# Altium schematic sheet top.SchDoc
size A2
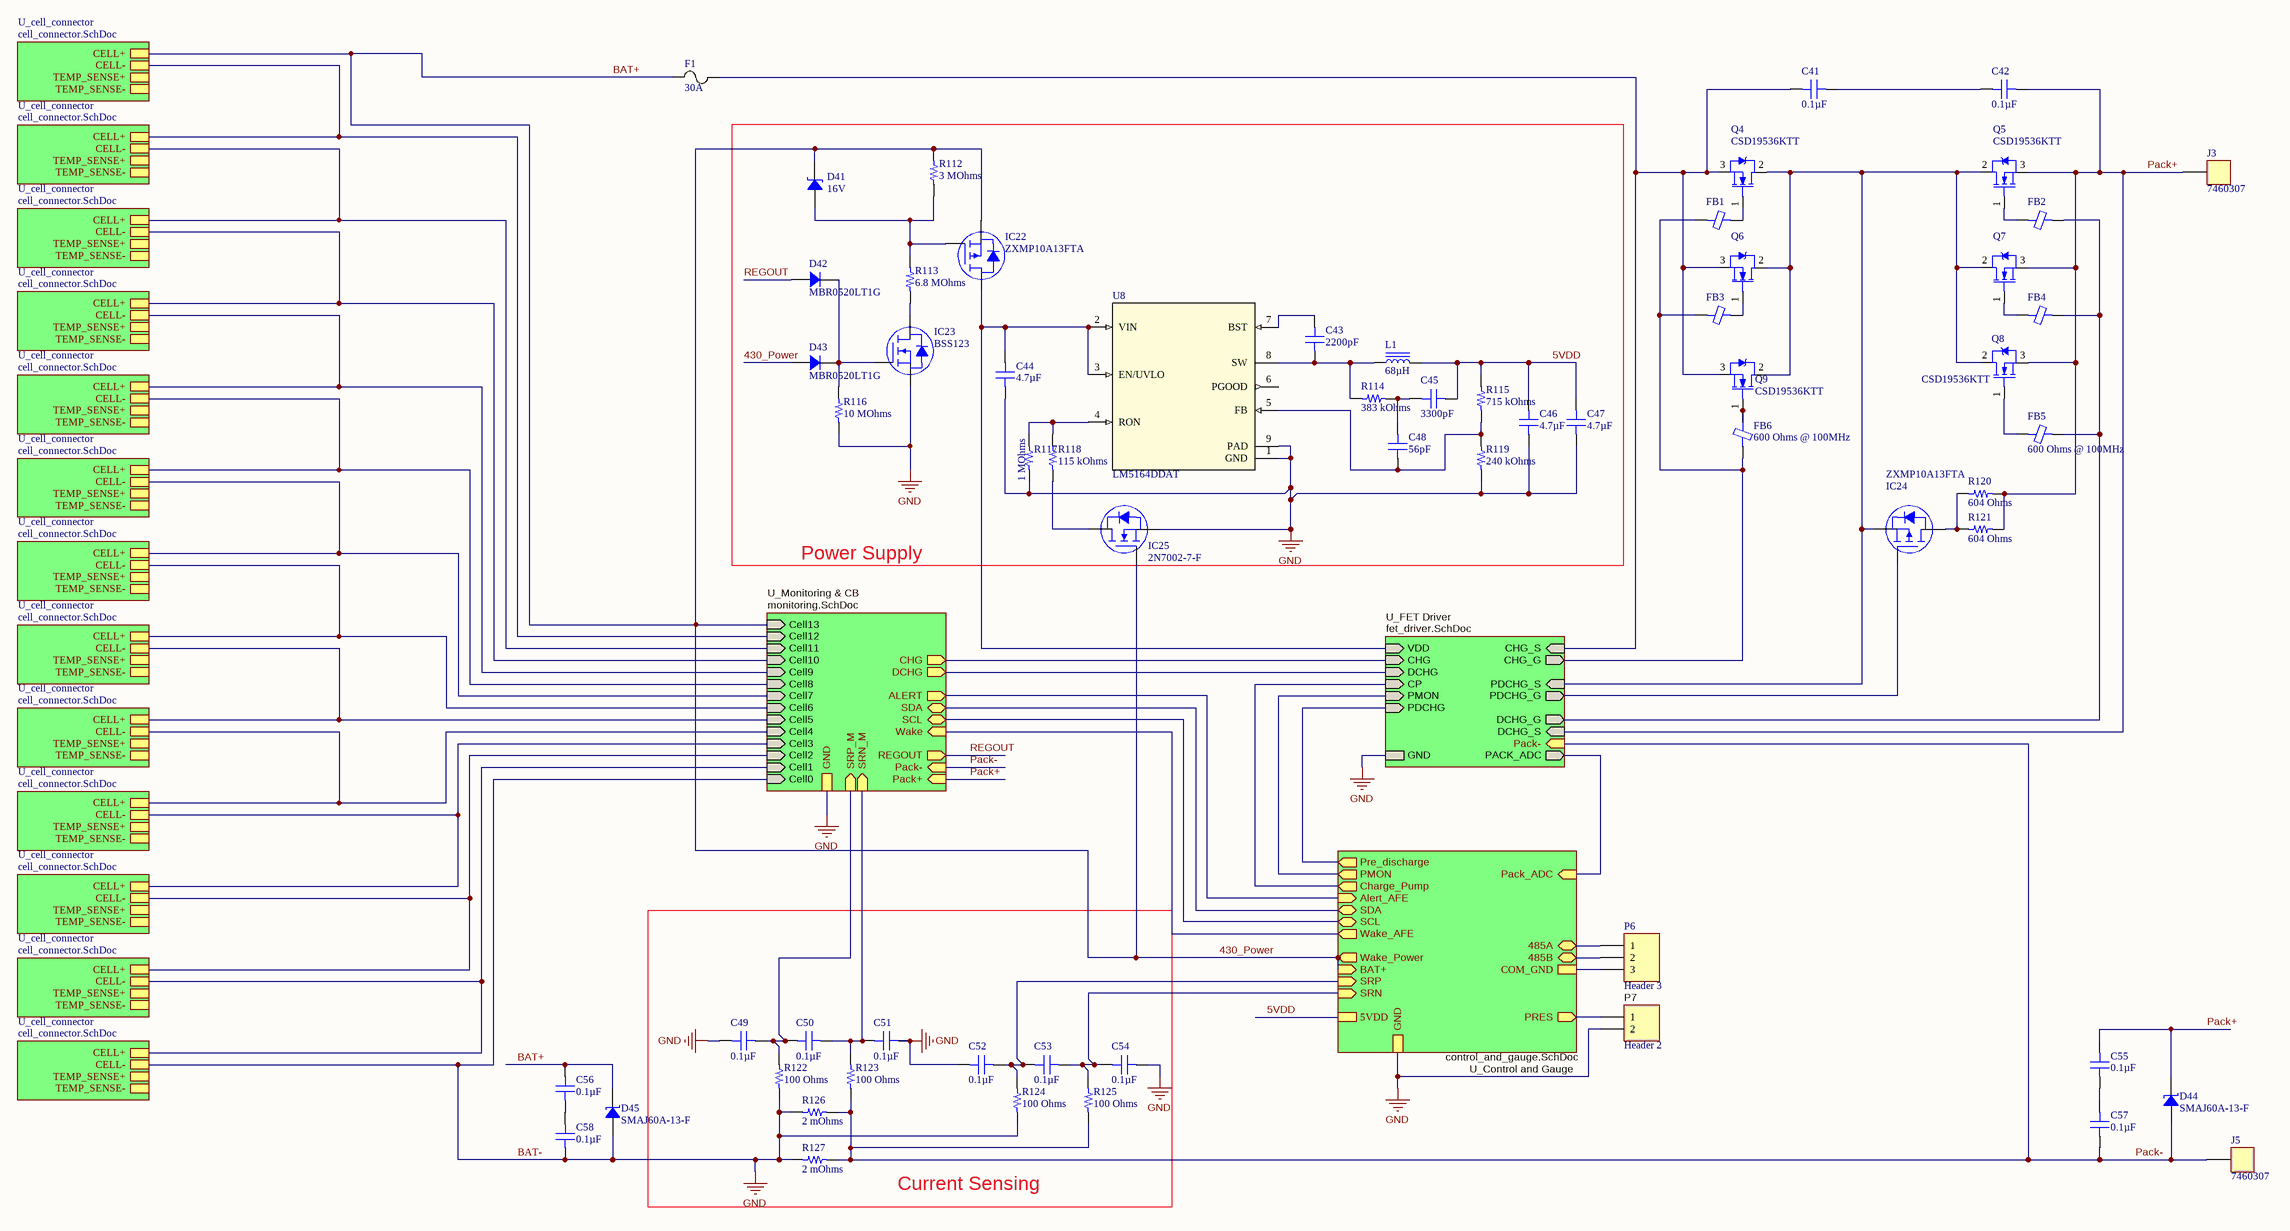
[diagram p0: top.SchDoc]

## Parts
C41  0.1µF  [CAP 0603_1608]
C42  0.1µF  [CAP 0603_1608]
C43  2200pF  [CAP 0603_1608]
C44  4.7µF  [CAP 1210_3225 - 2.2MM]
C45  3300pF  [CAP 0603_1608]
C46  4.7µF  [CAP 0805_2012]
C47  4.7µF  [CAP 0805_2012]
C48  56pF  [CAP 0603_1608]
C49  0.1µF  [CAP 0603_1608]
C50  0.1µF  [CAP 0603_1608]
C51  0.1µF  [CAP 0603_1608]
C52  0.1µF  [CAP 0603_1608]
C53  0.1µF  [CAP 0603_1608]
C54  0.1µF  [CAP 0603_1608]
C55  0.1µF  [CAP 0603_1608]
C56  0.1µF  [CAP 0603_1608]
C57  0.1µF  [CAP 0603_1608]
C58  0.1µF  [CAP 0603_1608]
D41  Voltage - Zener (Nom) (Vz): 16V  [SOD-123]  (hidden comment: MMSZ5246B-7-F)
D42  MBR0520LT1G  [SOD-123]
D43  MBR0520LT1G  [SOD-123]
D44  SMAJ60A-13-F  [DO214AC SMA]
D45  SMAJ60A-13-F  [DO214AC SMA]
F1  Fuse Current: 30A  [FUS_LITTELFUSE_0456_30A_LTF]  (hidden comment: 0456030.ER)
FB1  600 Ohms @ 100MHz  [FER 0603_1608]  (value not drawn)
FB2  600 Ohms @ 100MHz  [FER 0603_1608]  (value not drawn)
FB3  600 Ohms @ 100MHz  [FER 0603_1608]  (value not drawn)
FB4  600 Ohms @ 100MHz  [FER 0603_1608]  (value not drawn)
FB5  600 Ohms @ 100MHz  [FER 0603_1608]
FB6  600 Ohms @ 100MHz  [FER 0603_1608]
IC22  ZXMP10A13FTA  [DIODES SOT-23-3]
IC23  BSS123  [ON SEMI SOT-23-3]
IC24  ZXMP10A13FTA  [DIODES SOT-23-3]
IC25  2N7002-7-F  [DIODES SOT-23-3]
J3  7460307  [7460307]
J5  7460307  [7460307]
L1  68µH  [TDK SLF10145]
P6  Header 3  [HDR1X3]
P7  Header 2  [HDR1X2]
Q4  CSD19536KTT  [DDPAK]
Q5  CSD19536KTT  [DDPAK]
Q6  CSD19536KTT  [DDPAK]  (value not drawn)
Q7  CSD19536KTT  [DDPAK]  (value not drawn)
Q8  CSD19536KTT  [DDPAK]
Q9  CSD19536KTT  [DDPAK]
R112  3 MOhms  [RES 0603_1608]
R113  6.8 MOhms  [RES 0603_1608]
R114  383 kOhms  [RES 0603_1608]
R115  715 kOhms  [RES 0603_1608]
R116  10 MOhms  [RES 0603_1608]
R117  1 MOhms  [RES 0603_1608]
R118  115 kOhms  [RES 0603_1608]
R119  240 kOhms  [RES 0603_1608]
R120  604 Ohms  [RES 2512_6432]
R121  604 Ohms  [RES 2512_6432]
R122  100 Ohms  [RES 0603_1608]
R123  100 Ohms  [RES 0603_1608]
R124  100 Ohms  [RES 0603_1608]
R125  100 Ohms  [RES 0603_1608]
R126  2 mOhms  [STACKPOLE CSR2512]
R127  2 mOhms  [STACKPOLE CSR2512]
U8  LM5164DDAT  [PowerSOIC_8]

## Blocks framed on the sheet
Power Supply: C43-C48 D41-D43 IC22 IC23 IC25 L1 R112-R119 U8
Current Sensing: C49-C54 R122-R127

## Sub-sheets
U_cell_connector = cell_connector.SchDoc: CELL+, CELL-, TEMP_SENSE+, TEMP_SENSE-
U_cell_connector = cell_connector.SchDoc: CELL+, CELL-, TEMP_SENSE+, TEMP_SENSE-
U_cell_connector = cell_connector.SchDoc: CELL+, CELL-, TEMP_SENSE+, TEMP_SENSE-
U_cell_connector = cell_connector.SchDoc: CELL+, CELL-, TEMP_SENSE+, TEMP_SENSE-
U_cell_connector = cell_connector.SchDoc: CELL+, CELL-, TEMP_SENSE+, TEMP_SENSE-
U_cell_connector = cell_connector.SchDoc: CELL+, CELL-, TEMP_SENSE+, TEMP_SENSE-
U_cell_connector = cell_connector.SchDoc: CELL+, CELL-, TEMP_SENSE+, TEMP_SENSE-
U_cell_connector = cell_connector.SchDoc: CELL+, CELL-, TEMP_SENSE+, TEMP_SENSE-
U_cell_connector = cell_connector.SchDoc: CELL+, CELL-, TEMP_SENSE+, TEMP_SENSE-
U_cell_connector = cell_connector.SchDoc: CELL+, CELL-, TEMP_SENSE+, TEMP_SENSE-
U_cell_connector = cell_connector.SchDoc: CELL+, CELL-, TEMP_SENSE+, TEMP_SENSE-
U_cell_connector = cell_connector.SchDoc: CELL+, CELL-, TEMP_SENSE+, TEMP_SENSE-
U_cell_connector = cell_connector.SchDoc: CELL+, CELL-, TEMP_SENSE+, TEMP_SENSE-
U_Control and Gauge = control_and_gauge.SchDoc: SRP (in), SRN (in), BAT+ (in), Wake_Power (out), Wake_AFE (out), Alert_AFE (in), Pre_discharge (out), Charge_Pump (out), Pack_ADC (in), GND, 485B (bidir), 485A (bidir), PMON (out), SDA (bidir), SCL (bidir), PRES (out), 5VDD, COM_GND
U_FET Driver = fet_driver.SchDoc: DCHG_S (in), CHG_S (in), CHG_G (out), DCHG_G (out), PDCHG_G (out), CHG (in), CP (in), DCHG (in), PMON (in), PDCHG (in), PACK_ADC (out), VDD (in), GND, PDCHG_S (in), Pack- (in)
U_Monitoring & CB = monitoring.SchDoc: Cell0 (in), Cell1 (in), Cell2 (in), Cell3 (in), Cell4 (in), Cell5 (in), Cell6 (in), Cell7 (in), Cell8 (in), Cell9 (in), Cell10 (in), Cell11 (in), Cell12 (in), Cell13 (in), ALERT (out), CHG (out), DCHG (out), SDA (bidir), SCL (bidir), Pack+ (in), Pack- (in), Wake (in), REGOUT (out), GND, SRN_M (in), SRP_M (in)

## Nets
BAT-: C44.1 C46.1 C47.1 C49.1 C51.2 C52.1 C54.2 C58.1 D45.1 IC23.2(S) IC25.2(S) P7.2 R116.1 R117.2 R119.1 R122.2 R124.2 R126.1 R127.1 U8.1(GND) U8.9(PAD) ; sheet U_Monitoring & CB/Cell0, sheet U_Monitoring & CB/GND, sheet U_Control and Gauge/GND, sheet U_FET Driver/GND, sheet U_cell_connector/CELL-  [also labelled GND]
5VDD: C45.2 C46.2 C47.2 L1.2 R115.2 ; sheet U_Control and Gauge/5VDD
430_Power: C56.2 D41.2 D43.1 D45.2 F1.1 IC22.2(S) IC25.1(G) R112.2 ; sheet U_Monitoring & CB/Cell13, sheet U_Control and Gauge/BAT+, sheet U_Control and Gauge/Wake_Power, sheet U_cell_connector/CELL+  [also labelled BAT+]
Pack+: C42.1 C55.2 D44.2 J3.1 Q5.3(S) Q7.3(S) Q8.3(S) R120.2 R121.2 ; sheet U_Monitoring & CB/Pack+, sheet U_FET Driver/DCHG_S
Pack-: C57.1 D44.1 J5.1 R123.2 R125.2 R126.2 R127.2 ; sheet U_Monitoring & CB/Pack-, sheet U_FET Driver/Pack-
REGOUT: D42.1 ; sheet U_Monitoring & CB/REGOUT
NetC41_1: C41.1 C42.2
NetC41_2: C41.2 F1.2 Q4.3(S) Q6.3(S) Q9.3(S) ; sheet U_FET Driver/CHG_S
NetC43_1: C43.1 L1.1 R114.1 U8.8(SW)
NetC43_2: C43.2 U8.7(BST)
NetC44_2: C44.2 IC22.3(D) U8.2(VIN) U8.3(EN/UVLO) ; sheet U_FET Driver/VDD
NetC45_1: C45.1 C48.2 R114.2
NetC48_1: C48.1 R115.1 R119.2 U8.5(FB)
NetC49_2: C49.2 C50.1 R122.1 ; sheet U_Monitoring & CB/SRP_M
NetC50_2: C50.2 C51.1 R123.1 ; sheet U_Monitoring & CB/SRN_M
NetC52_2: C52.2 C53.1 R124.1 ; sheet U_Control and Gauge/SRP
NetC53_2: C53.2 C54.1 R125.1 ; sheet U_Control and Gauge/SRN
NetC55_1: C55.1 C57.2
NetC56_1: C56.1 C58.2
NetD41_1: D41.1 IC22.1(G) R112.1 R113.2
NetD42_2: D42.2 D43.2 IC23.1(G) R116.2
NetFB1_1: FB1.1 Q4.1(G)
NetFB1_2: FB1.2 FB3.2 FB6.1 ; sheet U_FET Driver/CHG_G
NetFB2_1: FB2.1 FB4.1 FB5.1 ; sheet U_FET Driver/DCHG_G
NetFB2_2: FB2.2 Q5.1(G)
NetFB3_1: FB3.1 Q6.1(G)
NetFB4_2: FB4.2 Q7.1(G)
NetFB5_2: FB5.2 Q8.1(G)
NetFB6_2: FB6.2 Q9.1(G)
NetIC23_3: IC23.3(D) R113.1
NetIC24_1: IC24.1(G) ; sheet U_FET Driver/PDCHG_G
NetIC24_2: IC24.2(S) Q4.2(D) Q5.2(D) Q6.2(D) Q7.2(D) Q8.2(D) Q9.2(D) ; sheet U_FET Driver/PDCHG_S
NetIC24_3: IC24.3(D) R120.1 R121.1
NetIC25_3: IC25.3(D) R118.1
NetP6_1: P6.1 ; sheet U_Control and Gauge/485A
NetP6_2: P6.2 ; sheet U_Control and Gauge/485B
NetP6_3: P6.3 ; sheet U_Control and Gauge/COM_GND
NetP7_1: P7.1 ; sheet U_Control and Gauge/PRES
NetR117_1: R117.1 R118.2 U8.4(RON)
(unnamed): sheet U_Monitoring & CB/Cell1, sheet U_cell_connector/CELL+, sheet U_cell_connector/CELL-
(unnamed): sheet U_Monitoring & CB/Cell2, sheet U_cell_connector/CELL+, sheet U_cell_connector/CELL-
(unnamed): sheet U_Monitoring & CB/Cell3, sheet U_cell_connector/CELL+, sheet U_cell_connector/CELL-
(unnamed): sheet U_Monitoring & CB/Cell4, sheet U_cell_connector/CELL+, sheet U_cell_connector/CELL-
(unnamed): sheet U_Monitoring & CB/Cell5, sheet U_cell_connector/CELL+, sheet U_cell_connector/CELL-
(unnamed): sheet U_Monitoring & CB/Cell6, sheet U_cell_connector/CELL+, sheet U_cell_connector/CELL-
(unnamed): sheet U_Monitoring & CB/Cell7, sheet U_cell_connector/CELL+, sheet U_cell_connector/CELL-
(unnamed): sheet U_Monitoring & CB/Cell8, sheet U_cell_connector/CELL+, sheet U_cell_connector/CELL-
(unnamed): sheet U_Monitoring & CB/Cell9, sheet U_cell_connector/CELL+, sheet U_cell_connector/CELL-
(unnamed): sheet U_Monitoring & CB/Cell10, sheet U_cell_connector/CELL+, sheet U_cell_connector/CELL-
(unnamed): sheet U_Monitoring & CB/Cell11, sheet U_cell_connector/CELL+, sheet U_cell_connector/CELL-
(unnamed): sheet U_Monitoring & CB/Cell12, sheet U_cell_connector/CELL+, sheet U_cell_connector/CELL-
(unnamed): sheet U_Monitoring & CB/ALERT, sheet U_Control and Gauge/Alert_AFE
(unnamed): sheet U_Monitoring & CB/CHG, sheet U_FET Driver/CHG
(unnamed): sheet U_Monitoring & CB/DCHG, sheet U_FET Driver/DCHG
(unnamed): sheet U_Monitoring & CB/SDA, sheet U_Control and Gauge/SDA
(unnamed): sheet U_Monitoring & CB/SCL, sheet U_Control and Gauge/SCL
(unnamed): sheet U_Monitoring & CB/Wake, sheet U_Control and Gauge/Wake_AFE
(unnamed): sheet U_Control and Gauge/Pre_discharge, sheet U_FET Driver/PDCHG
(unnamed): sheet U_Control and Gauge/Charge_Pump, sheet U_FET Driver/CP
(unnamed): sheet U_Control and Gauge/Pack_ADC, sheet U_FET Driver/PACK_ADC
(unnamed): sheet U_Control and Gauge/PMON, sheet U_FET Driver/PMON

Not connected (* = marked no-connect by the designer): U8 6(PGOOD)

## Library data of the parts
C41 C42 C55-C58 = GCJ188R72A104KA01D: CAP CER 0.1UF 100V X7R 0603; Manufacturer: Murata Electronics; Tolerance: ±10%; Part Number: GCJ188R72A104KA01D; Value: 0.1µF; Applications: Automotive, Boardflex Sensitive; Capacitance: 0.1µF; ComponentLink1Description: Datasheet; ComponentLink1URL: https://www.murata.com/~/media/webrenewal/support/library/catalog/products/capacitor/mlcc/c03e.ashx?la=en-us; ComponentLink2Description: DigiKey Link; ComponentLink2URL: http://digikey.com/product-detail/en/murata-electronics/GCJ188R72A104KA01D/490-13420-1-ND/6012292; Device Package: 0603 (1608 Metric); Features: Soft Termination; LastUpdated: 9/2/2020 1:03:01 AM; Lifecycle Status: Active; Minimum Order: 1; Mounting Type: Surface Mount, MLCC; Operating Temperature: -55°C ~ 125°C; Package / Case: 0603 (1608 Metric); Packaging: TapeAndReel; PartId: 17976; Part Status: Active; Price: 0.05; Ratings: AEC-Q200; Series: GCJ; Size / Dimension: 0.063" L x 0.031" W (1.60mm x 0.80mm); Supplier 1: DigiKey; Supplier Part Number 1: 490-13420-1-ND; Temperature Coefficient: X7R; Thickness (Max): 0.035" (0.90mm); Voltage - Rated: 100V
C43 = C1608C0G1H222J080AA: CAP CER 2200PF 50V C0G 0603; Manufacturer: TDK Corporation; Temperature Coefficient: C0G, NP0; Tolerance: ±5%; Part Number: C1608C0G1H222J080AA; Value: 2200pF; Applications: General Purpose; Capacitance: 2200pF; ComponentLink1Description: Datasheet; ComponentLink1URL: https://product.tdk.com/info/en/catalog/datasheets/mlcc_commercial_general_en.pdf?ref_disty=digikey; ComponentLink2Description: DigiKey Link; ComponentLink2URL: http://digikey.com/product-detail/en/tdk-corporation/C1608C0G1H222J080AA/445-1297-1-ND/567684; Device Package: 0603 (1608 Metric); Features: Low ESL; LastUpdated: 9/2/2020 1:03:24 AM; Lifecycle Status: Active; Minimum Order: 1; Mounting Type: Surface Mount, MLCC; Operating Temperature: -55°C ~ 125°C; Package / Case: 0603 (1608 Metric); Packaging: TapeAndReel; PartId: 8679; Part Status: Active; Price: 0.03; Series: C; Size / Dimension: 0.063" L x 0.031" W (1.60mm x 0.80mm); Supplier 1: DigiKey; Supplier Part Number 1: 445-1297-1-ND; Thickness (Max): 0.035" (0.90mm); Voltage - Rated: 50V
C44 = C3225X7S2A475K200AB: CAP CER 4.7UF 100V X7S 1210; Manufacturer: TDK Corporation; Tolerance: ±10%; Part Number: C3225X7S2A475K200AB; Value: 4.7µF; Applications: General Purpose; Capacitance: 4.7µF; ComponentLink1Description: Datasheet; ComponentLink1URL: https://product.tdk.com/info/en/catalog/datasheets/mlcc_commercial_midvoltage_en.pdf?ref_disty=digikey; ComponentLink2Description: DigiKey Link; ComponentLink2URL: http://digikey.com/product-detail/en/tdk-corporation/C3225X7S2A475K200AB/445-6042-1-ND/2444083; Device Package: 1210 (3225 Metric); LastUpdated: 9/2/2020 1:10:42 AM; Lifecycle Status: Active; Minimum Order: 1; Mounting Type: Surface Mount, MLCC; Operating Temperature: -55°C ~ 125°C; Package / Case: 1210 (3225 Metric); Packaging: TapeAndReel; PartId: 24496; Part Status: Active; Price: 0.50; Series: C; Size / Dimension: 0.126" L x 0.098" W (3.20mm x 2.50mm); Supplier 1: DigiKey; Supplier Part Number 1: 445-6042-1-ND; Temperature Coefficient: X7S; Thickness (Max): 0.087" (2.20mm); Voltage - Rated: 100V
C45 = CGA3E2X7R1H332K080AA: CAP CER 3300PF 50V X7R 0603; Manufacturer: TDK Corporation; Tolerance: ±10%; Part Number: CGA3E2X7R1H332K080AA; Value: 3300pF; Applications: Automotive; Capacitance: 3300pF; ComponentLink1Description: Datasheet; ComponentLink1URL: https://product.tdk.com/info/en/catalog/datasheets/mlcc_automotive_general_en.pdf?ref_disty=digikey; ComponentLink2Description: DigiKey Link; ComponentLink2URL: http://digikey.com/product-detail/en/tdk-corporation/CGA3E2X7R1H332K080AA/445-6921-1-ND/2672939; Device Package: 0603 (1608 Metric); LastUpdated: 9/2/2020 1:03:02 AM; Lifecycle Status: Active; Minimum Order: 1; Mounting Type: Surface Mount, MLCC; Operating Temperature: -55°C ~ 125°C; Package / Case: 0603 (1608 Metric); Packaging: TapeAndReel; PartId: 17741; Part Status: Active; Price: 0.01; Ratings: AEC-Q200; Series: CGA; Size / Dimension: 0.063" L x 0.031" W (1.60mm x 0.80mm); Supplier 1: DigiKey; Supplier Part Number 1: 445-6921-1-ND; Temperature Coefficient: X7R; Thickness (Max): 0.035" (0.90mm); Voltage - Rated: 50V
C46 C47 = CC0805KKX7R7BB475: CAP CER 4.7UF 16V X7R 0805; Manufacturer: Yageo; Tolerance: ±10%; Part Number: CC0805KKX7R7BB475; Value: 4.7µF; Applications: General Purpose; Capacitance: 4.7µF; ComponentLink1Description: Datasheet; ComponentLink1URL: https://www.yageo.com/upload/media/product/productsearch/datasheet/mlcc/UPY-GPHC_X7R_6.3V-to-50V_18.pdf; ComponentLink2Description: DigiKey Link; ComponentLink2URL: http://digikey.com/product-detail/en/yageo/CC0805KKX7R7BB475/311-1883-1-ND/5195785; Device Package: 0805 (2012 Metric); LastUpdated: 9/2/2020 1:04:23 AM; Lifecycle Status: Active; Minimum Order: 1; Mounting Type: Surface Mount, MLCC; Operating Temperature: -55°C ~ 125°C; Package / Case: 0805 (2012 Metric); Packaging: TapeAndReel; PartId: 12987; Part Status: Active; Price: 0.09; Series: CC; Size / Dimension: 0.079" L x 0.049" W (2.00mm x 1.25mm); Supplier 1: DigiKey; Supplier Part Number 1: 311-1883-1-ND; Temperature Coefficient: X7R; Thickness (Max): 0.057" (1.45mm); Voltage - Rated: 16V
C48 = CGA3E2C0G1H560J080AA: CAP CER 56PF 50V C0G 0603; Manufacturer: TDK Corporation; Temperature Coefficient: C0G, NP0; Tolerance: ±5%; Part Number: CGA3E2C0G1H560J080AA; Value: 56pF; Applications: Automotive; Capacitance: 56pF; ComponentLink1Description: Datasheet; ComponentLink1URL: https://product.tdk.com/info/en/catalog/datasheets/mlcc_automotive_general_en.pdf?ref_disty=digikey; ComponentLink2Description: DigiKey Link; ComponentLink2URL: http://digikey.com/product-detail/en/tdk-corporation/CGA3E2C0G1H560J080AA/445-5637-1-ND/2443677; Device Package: 0603 (1608 Metric); LastUpdated: 9/2/2020 1:03:10 AM; Lifecycle Status: Active; Minimum Order: 1; Mounting Type: Surface Mount, MLCC; Operating Temperature: -55°C ~ 125°C; Package / Case: 0603 (1608 Metric); Packaging: TapeAndReel; PartId: 15276; Part Status: Active; Price: 0.03; Ratings: AEC-Q200; Series: CGA; Size / Dimension: 0.063" L x 0.031" W (1.60mm x 0.80mm); Supplier 1: DigiKey; Supplier Part Number 1: 445-5637-1-ND; Thickness (Max): 0.035" (0.90mm); Voltage - Rated: 50V
C49-C54 = GCJ188R71H104KA12D: CAP CER 0.1UF 50V X7R 0603; Manufacturer: Murata Electronics; Tolerance: ±10%; Part Number: GCJ188R71H104KA12D; Value: 0.1µF; Applications: Automotive, Boardflex Sensitive; Capacitance: 0.1µF; ComponentLink1Description: Datasheet; ComponentLink1URL: https://www.murata.com/~/media/webrenewal/support/library/catalog/products/capacitor/mlcc/c03e.ashx?la=en-us; ComponentLink2Description: DigiKey Link; ComponentLink2URL: http://digikey.com/product-detail/en/murata-electronics/GCJ188R71H104KA12D/490-5798-1-ND/2783823; Device Package: 0603 (1608 Metric); Features: Soft Termination; LastUpdated: 9/2/2020 1:03:05 AM; Lifecycle Status: Active; Minimum Order: 1; Mounting Type: Surface Mount, MLCC; Operating Temperature: -55°C ~ 125°C; Package / Case: 0603 (1608 Metric); Packaging: TapeAndReel; PartId: 16867; Part Status: Active; Price: 0.02; Ratings: AEC-Q200; Series: GCJ; Size / Dimension: 0.063" L x 0.031" W (1.60mm x 0.80mm); Supplier 1: DigiKey; Supplier Part Number 1: 490-5798-1-ND; Temperature Coefficient: X7R; Thickness (Max): 0.035" (0.90mm); Voltage - Rated: 50V
D41 = MMSZ5246B-7-F: DIODE ZENER 16V 500MW SOD123; Manufacturer: Diodes Incorporated; Current - Reverse Leakage @ Vr: 100nA @ 12V; Impedance (Max) (Zzt): 17 Ohms; Tolerance: ±5%; Voltage - Forward (Vf) (Max) @ If: 900mV @ 10mA; Part Number: MMSZ5246B-7-F; ComponentLink1Description: Datasheet; ComponentLink1URL: https://www.diodes.com/assets/Datasheets/ds18010.pdf; ComponentLink2Description: DigiKey Link; ComponentLink2URL: http://digikey.com/product-detail/en/diodes-incorporated/MMSZ5246B-7-F/MMSZ5246B-FDICT-ND/717912; LastUpdated: 9/2/2020 1:19:27 AM; Lifecycle Status: Active; Minimum Order: 1; Mounting Type: Surface Mount; Operating Temperature: -65°C ~ 150°C; Package / Case: SOD-123; Packaging: TapeAndReel; PartId: 1896; Part Status: Active; Power - Max: 500mW; Price: 0.04; Series: -; Supplier 1: DigiKey; Supplier Part Number 1: MMSZ5246B-FDICT-ND; Supplier Device Package: SOD-123
D42 D43 = MBR0520LT1G: DIODE SCHOTTKY 20V 500MA SOD123; Manufacturer: ON Semiconductor; Current - Reverse Leakage @ Vr: 250µA @ 20V; Speed: Fast Recovery =< 500ns, > 200mA (Io); Voltage - Forward (Vf) (Max) @ If: 385mV @ 500mA; Part Number: MBR0520LT1G; ComponentLink1Description: Datasheet; ComponentLink1URL: http://www.onsemi.com/pub/Collateral/MBR0520LT1-D.PDF; ComponentLink2Description: DigiKey Link; ComponentLink2URL: http://digikey.com/product-detail/en/on-semiconductor/MBR0520LT1G/MBR0520LT1GOSCT-ND/917965; Current - Average Rectified (Io): 500mA; Diode Type: Schottky; LastUpdated: 9/2/2020 1:19:08 AM; Lifecycle Status: Active; Minimum Order: 1; Mounting Type: Surface Mount; Operating Temperature - Junction: -65°C ~ 125°C; Package / Case: SOD-123; Packaging: TapeAndReel; PartId: 2222; Part Status: Active; Price: 0.05; Series: -; Supplier 1: DigiKey; Supplier Part Number 1: MBR0520LT1GOSCT-ND; Supplier Device Package: SOD-123; Voltage - DC Reverse (Vr) (Max): 20V
D44 D45 = SMAJ60A-13-F: TVS DIODE 60V 96.8V SMA; Manufacturer: Diodes Incorporated; Current - Peak Pulse (10/1000µs): 4.1A; Power Line Protection: No; Power - Peak Pulse: 400W; Type: Zener; Unidirectional Channels: 1; Voltage - Breakdown (Min): 66.7V; Part Number: SMAJ60A-13-F; Applications: General Purpose; ComponentLink1Description: Datasheet; ComponentLink1URL: https://www.diodes.com/assets/Datasheets/ds19005.pdf; ComponentLink2Description: DigiKey Link; ComponentLink2URL: http://digikey.com/product-detail/en/diodes-incorporated/SMAJ60A-13-F/SMAJ60A-FDICT-ND/775872; LastUpdated: 9/2/2020 1:20:16 AM; Lifecycle Status: Active; Minimum Order: 1; Mounting Type: Surface Mount; Operating Temperature: -55°C ~ 150°C (TJ); Package / Case: DO-214AC, SMA; Packaging: TapeAndReel; PartId: 5958; Part Status: Active; Price: 0.08; Series: -; Supplier 1: DigiKey; Supplier Part Number 1: SMAJ60A-FDICT-ND; Supplier Device Package: SMA; Voltage - Clamping (Max) @ Ipp: 96.8V; Voltage - Reverse Standoff (Typ): 60V
F1 = 0456030.ER: AC DC Fuse Board Mount (Cartridge Style Excluded) Surface Mount 2-SMD, Square End Block; Manufacturer: Littelfuse; Vendor: Littelfuse Inc; Built_By: EMA_UL_Team; SourceLibrary: Littelfuse_2002-01-01_FUSE_0400; Type: DEV; Body Material: Ceramic; Voltage Rating (AC): 125V; Voltage Rating (DC): 72V; Resistance: 1.32mR; Approvals: cULus,PSE; Manufacturer_Part_Number: 0456030.ER; Copyright: Copyright (C) 2018 Accelerated Designs. All rights reserved; RefDes: RefDes; Supplier 1: Digi-Key; Manufacturer Part Number: 0456030.ER; Stock 1: 4934; Pricing 1: 1=4.23, 5=4.092, 10=3.951, 50=3.104, 100=2.5396, 250=2.46908, 500=2.11636, 1000=1.97526 (USD); Mount: Surface Mount; Case/Package: SMD/SMT; Number of Pins: 2; Housing Material: Ceramic; Min Operating Temperature: -55°C; Max Operating Temperature: 125°C; Current Rating: 30A; Package Quantity: 2500; Voltage Rating: 125V; Packaging: Tape and Reel; Termination: SMD/SMT; DC Cold Resistance: 1.32mR; Fuse Type: Board Mount (Cartridge Style Excluded); Working Voltage: 125V; Length: 10.1mm; Width: 4.445mm; Height: 0.123inch; Depth: 3.12mm; Radiation Hardening: No; Lead Free: Lead Free; REACH SVHC: No SVHC; ComponentLink1URL: http://www.farnell.com/datasheets/1851809.pdf?src-supplier=Element14; ComponentLink1Description: http://www.farnell.com/datasheets/1851809.pdf?src-supplier=Element14; ComponentLink2URL: http://www.littelfuse.com/~/media/electronics/datasheets/fuses/littelfuse_fuse_456_datasheet.pdf.pdf?src-supplier=Digi-Key; ComponentLink2Description: http://www.littelfuse.com/~/media/electronics/datasheets/fuses/littelfuse_fuse_456_datasheet.pdf.pdf?src-supplier=Digi-Key; ComponentLink3URL: http://uk.rs-online.com/webdocs/1185/0900766b81185b84.pdf?src-supplier=RSComponents; ComponentLink3Description: http://uk.rs-online.com/webdocs/1185/0900766b81185b84.pdf?src-supplier=RSComponents; ComponentLink4URL: http://www.littelfuse.com/data/en/Data_Sheets/Littelfuse_Fuse_456.pdf?src-supplier=Future+Electronics; ComponentLink4Description: http://www.littelfuse.com/data/en/Data_Sheets/Littelfuse_Fuse_456.pdf?src-supplier=Future+Electronics; ComponentLink5URL: http://www.farnell.com/datasheets/1851809.pdf?src-supplier=Newark; ComponentLink5Description: http://www.farnell.com/datasheets/1851809.pdf?src-supplier=Newark; ComponentLink6URL: https://www.verical.com/server-webapp/html/getDatasheet?partID=306944&src-supplier=Verical; ComponentLink6Description: https://www.verical.com/server-webapp/html/getDatasheet?partID=306944&src-supplier=Verical; Supplier Part Number 1: F3345CT-ND
FB1-FB6 = 74279265: FERRITE BEAD 600 OHM 0603 1LN; Manufacturer: Würth Elektronik; Current Rating (Max): 200mA; DC Resistance (DCR) (Max): 450mOhm; Filter Type: Signal Line; Number of Lines: 1; Part Number: 74279265; ComponentLink1Description: Datasheet; ComponentLink1URL: https://katalog.we-online.de/pbs/datasheet/74279265.pdf; ComponentLink2Description: DigiKey Link; ComponentLink2URL: http://digikey.com/product-detail/en/w-rth-elektronik/74279265/732-1583-1-ND/1639527; Device Package: 0603 (1608 Metric); Height (Max): 0.039" (1.00mm); Impedance @ Frequency: 600 Ohms @ 100MHz; LastUpdated: 9/2/2020 1:18:17 AM; Lifecycle Status: Active; Minimum Order: 1; Mounting Type: Surface Mount; Operating Temperature: -55°C ~ 125°C; Package / Case: 0603 (1608 Metric); Packaging: TapeAndReel; PartId: 1100; Part Status: Active; Price: 0.10; Series: WE-CBF; Size / Dimension: 0.063" L x 0.032" W (1.60mm x 0.80mm); Supplier 1: DigiKey; Supplier Part Number 1: 732-1583-1-ND; Value: 600 Ohms @ 100MHz
IC22 IC24 = ZXMP10A13FTA: MOSFET P-CH 100V 0.6A SOT23-3; Manufacturer: Diodes Incorporated; Current - Continuous Drain (Id) @ 25°C: 600mA (Ta); Drive Voltage (Max Rds On,  Min Rds On): 6V, 10V; FET Type: P-Channel; Gate Charge (Qg) (Max) @ Vgs: 3.5nC @ 10V; Input Capacitance (Ciss) (Max) @ Vds: 141pF @ 50V; Power Dissipation (Max): 625mW (Ta); Rds On (Max) @ Id, Vgs: 1Ohm @ 600mA, 10V; Vgs (Max): ±20V; Vgs(th) (Max) @ Id: 4V @ 250µA; Part Number: ZXMP10A13FTA; ComponentLink1Description: Datasheet; ComponentLink1URL: https://www.diodes.com/assets/Datasheets/ZXMP10A13F.pdf; ComponentLink2Description: DigiKey Link; ComponentLink2URL: http://digikey.com/product-detail/en/diodes-incorporated/ZXMP10A13FTA/ZXMP10A13FCT-ND/560670; Drain to Source Voltage (Vdss): 100V; LastUpdated: 9/2/2020 1:25:04 AM; Lifecycle Status: Active; Minimum Order: 1; Mounting Type: Surface Mount; Operating Temperature: -55°C ~ 150°C (TJ); Package / Case: TO-236-3, SC-59, SOT-23-3; Packaging: TapeAndReel; Part Status: Active; Price: 0.20; Series: -; Supplier 1: DigiKey; Supplier Part Number 1: ZXMP10A13FCT-ND; Supplier Device Package: SOT-23-3; Technology: MOSFET (Metal Oxide)
IC23 = BSS123: MOSFET N-CH 100V 170MA SOT-23; Manufacturer: ON Semiconductor; Current - Continuous Drain (Id) @ 25°C: 170mA (Ta); Drive Voltage (Max Rds On,  Min Rds On): 4.5V, 10V; FET Type: N-Channel; Gate Charge (Qg) (Max) @ Vgs: 2.5nC @ 10V; Input Capacitance (Ciss) (Max) @ Vds: 73pF @ 25V; Power Dissipation (Max): 360mW (Ta); Rds On (Max) @ Id, Vgs: 6Ohm @ 170mA, 10V; Vgs (Max): ±20V; Vgs(th) (Max) @ Id: 2V @ 1mA; Part Number: BSS123; ComponentLink1Description: Datasheet; ComponentLink1URL: https://www.onsemi.com/pub/Collateral/BSS123-D.PDF; ComponentLink2Description: DigiKey Link; ComponentLink2URL: http://digikey.com/product-detail/en/on-semiconductor/BSS123/BSS123NCT-ND/244665; Drain to Source Voltage (Vdss): 100V; LastUpdated: 9/2/2020 1:25:08 AM; Lifecycle Status: Active; Minimum Order: 1; Mounting Type: Surface Mount; Operating Temperature: -55°C ~ 150°C (TJ); Package / Case: TO-236-3, SC-59, SOT-23-3; Packaging: TapeAndReel; Part Status: Active; Price: 0.06; Series: -; Supplier 1: DigiKey; Supplier Part Number 1: BSS123NCT-ND; Supplier Device Package: SOT-23-3; Technology: MOSFET (Metal Oxide)
IC25 = 2N7002-7-F: MOSFET N-CH 60V 115MA SOT23-3; Manufacturer: Diodes Incorporated; Current - Continuous Drain (Id) @ 25°C: 115mA (Ta); Drive Voltage (Max Rds On,  Min Rds On): 5V, 10V; FET Type: N-Channel; Input Capacitance (Ciss) (Max) @ Vds: 50pF @ 25V; Power Dissipation (Max): 370mW (Ta); Rds On (Max) @ Id, Vgs: 7.5Ohm @ 50mA, 5V; Vgs (Max): ±20V; Vgs(th) (Max) @ Id: 2.5V @ 250µA; Part Number: 2N7002-7-F; ComponentLink1Description: Datasheet; ComponentLink1URL: https://www.diodes.com/assets/Datasheets/ds11303.pdf; ComponentLink2Description: DigiKey Link; ComponentLink2URL: http://digikey.com/product-detail/en/diodes-incorporated/2N7002-7-F/2N7002-FDICT-ND/717800; Drain to Source Voltage (Vdss): 60V; LastUpdated: 9/2/2020 1:25:03 AM; Lifecycle Status: Active; Minimum Order: 1; Mounting Type: Surface Mount; Operating Temperature: -55°C ~ 150°C (TJ); Package / Case: TO-236-3, SC-59, SOT-23-3; Packaging: TapeAndReel; Part Status: Active; Price: 0.03; Series: -; Supplier 1: DigiKey; Supplier Part Number 1: 2N7002-FDICT-ND; Supplier Device Package: SOT-23-3; Technology: MOSFET (Metal Oxide)
J3 J5 = 7460307: TERM REDCUBE M4 8PIN PCB 160A Current; Manufacturer: Wurth Electronics; Number of Contacts: 8; Insulation: Non-Insulated; Datasheet Link: https://katalog.we-online.com/em/datasheet/7460307.pdf; Height: 7mm; Mouser Part Number: 710-7460307; Mouser Price/Stock: https://www.mouser.co.uk/ProductDetail/Wurth-Elektronik/7460307?qs=lykWx4dhCCG1TLZtVq%252B8cQ%3D%3D; Supplier 1: Digi-Key; Manufacturer Part Number: 7460307; Stock 1: 4846; Pricing 1: 1=2.55, 10=2.356, 50=2.142, 100=1.947, 500=1.693 (USD); Mount: Through Hole; Number of Pins: 8; Contact Material: Copper; Contact Plating: Tin; Min Operating Temperature: -40°C; Max Operating Temperature: 135°C; Current Rating: 160A; Packaging: Bulk; Package Quantity: 250; Number of Rows: 2; Termination: Press-Fit; Length: 9mm; Width: 9mm; Thread Size: M4; REACH SVHC: Unknown; ComponentLink1URL: http://www.farnell.com/datasheets/1736661.pdf?src-supplier=Newark; ComponentLink1Description: http://www.farnell.com/datasheets/1736661.pdf?src-supplier=Newark; ComponentLink2URL: http://www.mouser.com/ds/2/445/7460307-537852.pdf?src-supplier=Mouser; ComponentLink2Description: http://www.mouser.com/ds/2/445/7460307-537852.pdf?src-supplier=Mouser; ComponentLink3URL: https://katalog.we-online.de/em/datasheet/7460307.pdf?src-supplier=Digi-Key; ComponentLink3Description: https://katalog.we-online.de/em/datasheet/7460307.pdf?src-supplier=Digi-Key; ComponentLink4URL: http://www.farnell.com/datasheets/1736661.pdf?src-supplier=Element14; ComponentLink4Description: http://www.farnell.com/datasheets/1736661.pdf?src-supplier=Element14; Supplier Part Number 1: 732-3201-ND
L1 = SLF10145T-680M1R2-PF: FIXED IND 68UH 1.3A 168 MOHM SMD; Manufacturer: TDK Corporation; Current - Saturation: 1.2A; DC Resistance (DCR): 168mOhm Max; Inductance Frequency - Test: 1kHz; Material - Core: Ferrite; Shielding: Shielded; Tolerance: ±20%; Type: Wirewound; Part Number: SLF10145T-680M1R2-PF; ComponentLink1Description: Datasheet; ComponentLink1URL: https://product.tdk.com/info/en/catalog/datasheets/inductor_commercial_power_slf10145_en.pdf?ref_disty=digikey; ComponentLink2Description: DigiKey Link; ComponentLink2URL: http://digikey.com/product-detail/en/tdk-corporation/SLF10145T-680M1R2-PF/445-1987-1-ND/755394; Current Rating (Amps): 1.3A; Device Package: Nonstandard; Height - Seated (Max): 0.189" (4.80mm); Inductance: 68µH; LastUpdated: 9/2/2020 1:22:12 AM; Lifecycle Status: Active; Minimum Order: 1; Mounting Type: Surface Mount; Operating Temperature: -40°C ~ 105°C; Package / Case: Nonstandard; Packaging: TapeAndReel; PartId: 81; Part Status: Active; Price: 0.54; Series: SLF; Size / Dimension: 0.398" L x 0.398" W (10.10mm x 10.10mm); Supplier 1: DigiKey; Supplier Part Number 1: 445-1987-1-ND; Value: 68µH
P6 = Header 3: Header, 3-Pin; LatestRevisionDate: 17-Jul-2002; LatestRevisionNote: Re-released for DXP Platform.; Publisher: Altium Limited
P7 = Header 2: Header, 2-Pin; LatestRevisionDate: 17-Jul-2002; LatestRevisionNote: Re-released for DXP Platform.; Publisher: Altium Limited
Q4-Q9 = CSD19536KTT: This 100 V, 2.0 m D2PAK (TO-263) NexFET power MOSFET is designed to minimize losses in power conversion applications.; Manufacturer: Texas Instruments; Drain to Source Voltage (Vdss): 100V; Continuous Drain Current (ID): 200A; Rds On Max: 2.4mR; Input Capacitance: 12nF; Max Power Dissipation: 375W; Fall Time: 6ns; Gate to Source Voltage (Vgs): 20V; Rise Time: 8ns; Turn-On Delay Time: 13ns; Turn-Off Delay Time: 32ns; Element Configuration: Single; Supplier 1: Digi-Key; Manufacturer Part Number: CSD19536KTT; Stock 1: 4702; Pricing 1: 1=4.98, 10=4.47, 25=4.2256, 100=3.3804 (USD); Mount: Surface Mount; Case/Package: D2PAK; Contact Plating: Tin; Min Operating Temperature: -55°C; Max Operating Temperature: 175°C; Packaging: Tape and Reel; Lead Free: Contains Lead; ComponentLink1URL: http://www.ti.com/lit/gpn/csd19536ktt?src-supplier=Mouser; ComponentLink1Description: http://www.ti.com/lit/gpn/csd19536ktt?src-supplier=Mouser; ComponentLink2URL: http://www.ti.com/general/docs/lit/getliterature.tsp?genericPartNumber=CSD19536KTT&amp;&amp;fileType=pdf&src-supplier=Avnet+Asia; ComponentLink2Description: http://www.ti.com/general/docs/lit/getliterature.tsp?genericPartNumber=CSD19536KTT&amp;&amp;fileType=pdf&src-supplier=Avnet+Asia; ComponentLink3URL: http://www.ti.com/lit/ds/symlink/csd19536ktt.pdf?src-supplier=Digi-Key; ComponentLink3Description: http://www.ti.com/lit/ds/symlink/csd19536ktt.pdf?src-supplier=Digi-Key; ComponentLink4URL: http://www.ti.com/general/docs/suppproductinfo.tsp?distId=10&amp;gotoUrl=http%3A%2F%2Fwww.ti.com%2Flit%2Fgpn%2Fcsd19536ktt&src-supplier=Digi-Key; ComponentLink4Description: http://www.ti.com/general/docs/suppproductinfo.tsp?distId=10&amp;gotoUrl=http%3A%2F%2Fwww.ti.com%2Flit%2Fgpn%2Fcsd19536ktt&src-supplier=Digi-Key; ComponentLink5URL: http://www.ti.com/general/docs/lit/getliterature.tsp?genericPartNumber=CSD19536KTT&&fileType=pdf&src-supplier=Avnet; ComponentLink5Description: http://www.ti.com/general/docs/lit/getliterature.tsp?genericPartNumber=CSD19536KTT&&fileType=pdf&src-supplier=Avnet; Supplier Part Number 1: 296-47254-6-ND
R112 = CRCW06033M00FKEA: RES SMD 3M OHM 1% 1/10W 0603; Manufacturer: Vishay Dale; Power (Watts): 0.1W, 1/10W; Temperature Coefficient: ±100ppm/°C; Part Number: CRCW06033M00FKEA; Value: 3 MOhms; ComponentLink1Description: Datasheet; ComponentLink1URL: http://www.vishay.com/docs/20035/dcrcwe3.pdf; ComponentLink2Description: DigiKey Link; ComponentLink2URL: http://digikey.com/product-detail/en/vishay-dale/CRCW06033M00FKEA/541-3.00MHCT-ND/1180204; Composition: Thick Film; Device Package: 0603 (1608 Metric); Features: Automotive AEC-Q200; Height - Seated (Max): 0.020" (0.50mm); LastUpdated: 9/2/2020 1:09:51 AM; Lifecycle Status: Active; Minimum Order: 1; Number of Terminations: 2; Operating Temperature: -55°C ~ 155°C; Package / Case: 0603 (1608 Metric); Packaging: CutTape; PartId: 20380; Part Status: Active; Price: 0.10; Ratings: AEC-Q200; Resistance: 3 MOhms; Series: CRCW; Size / Dimension: 0.061" L x 0.033" W (1.55mm x 0.85mm); Supplier 1: DigiKey; Supplier Part Number 1: 541-3.00MHCT-ND; Supplier Device Package: 0603; Tolerance: ±1%
R113 = CRCW06036M80FKEA: RES SMD 6.8M OHM 1% 1/10W 0603; Manufacturer: Vishay Dale; Power (Watts): 0.1W, 1/10W; Temperature Coefficient: ±100ppm/°C; Part Number: CRCW06036M80FKEA; Value: 6.8 MOhms; ComponentLink1Description: Datasheet; ComponentLink1URL: http://www.vishay.com/docs/20035/dcrcwe3.pdf; ComponentLink2Description: DigiKey Link; ComponentLink2URL: http://digikey.com/product-detail/en/vishay-dale/CRCW06036M80FKEA/541-6.80MHCT-ND/1180247; Composition: Thick Film; Device Package: 0603 (1608 Metric); Features: Automotive AEC-Q200; Height - Seated (Max): 0.020" (0.50mm); LastUpdated: 9/2/2020 1:09:37 AM; Lifecycle Status: Active; Minimum Order: 1; Number of Terminations: 2; Operating Temperature: -55°C ~ 155°C; Package / Case: 0603 (1608 Metric); Packaging: CutTape; PartId: 24550; Part Status: Active; Price: 0.10; Ratings: AEC-Q200; Resistance: 6.8 MOhms; Series: CRCW; Size / Dimension: 0.061" L x 0.033" W (1.55mm x 0.85mm); Supplier 1: DigiKey; Supplier Part Number 1: 541-6.80MHCT-ND; Supplier Device Package: 0603; Tolerance: ±1%
R114 = CRCW0603383KFKEA: RES SMD 383K OHM 1% 1/10W 0603; Manufacturer: Vishay Dale; Power (Watts): 0.1W, 1/10W; Temperature Coefficient: ±100ppm/°C; Part Number: CRCW0603383KFKEA; Value: 383 kOhms; ComponentLink1Description: Datasheet; ComponentLink1URL: http://www.vishay.com/docs/20035/dcrcwe3.pdf; ComponentLink2Description: DigiKey Link; ComponentLink2URL: http://digikey.com/product-detail/en/vishay-dale/CRCW0603383KFKEA/541-383KHCT-ND/1180103; Composition: Thick Film; Device Package: 0603 (1608 Metric); Features: Automotive AEC-Q200; Height - Seated (Max): 0.020" (0.50mm); LastUpdated: 9/2/2020 1:09:44 AM; Lifecycle Status: Active; Minimum Order: 1; Number of Terminations: 2; Operating Temperature: -55°C ~ 155°C; Package / Case: 0603 (1608 Metric); Packaging: CutTape; PartId: 22977; Part Status: Active; Price: 0.10; Ratings: AEC-Q200; Resistance: 383 kOhms; Series: CRCW; Size / Dimension: 0.061" L x 0.033" W (1.55mm x 0.85mm); Supplier 1: DigiKey; Supplier Part Number 1: 541-383KHCT-ND; Supplier Device Package: 0603; Tolerance: ±1%
R115 = CRCW0603715KFKEA: RES SMD 715K OHM 1% 1/10W 0603; Manufacturer: Vishay Dale; Power (Watts): 0.1W, 1/10W; Temperature Coefficient: ±100ppm/°C; Part Number: CRCW0603715KFKEA; Value: 715 kOhms; ComponentLink1Description: Datasheet; ComponentLink1URL: http://www.vishay.com/docs/20035/dcrcwe3.pdf; ComponentLink2Description: DigiKey Link; ComponentLink2URL: http://digikey.com/product-detail/en/vishay-dale/CRCW0603715KFKEA/541-715KHCT-ND/1180136; Composition: Thick Film; Device Package: 0603 (1608 Metric); Features: Automotive AEC-Q200; Height - Seated (Max): 0.020" (0.50mm); LastUpdated: 9/2/2020 1:09:44 AM; Lifecycle Status: Active; Minimum Order: 1; Number of Terminations: 2; Operating Temperature: -55°C ~ 155°C; Package / Case: 0603 (1608 Metric); Packaging: CutTape; PartId: 22983; Part Status: Active; Price: 0.10; Ratings: AEC-Q200; Resistance: 715 kOhms; Series: CRCW; Size / Dimension: 0.061" L x 0.033" W (1.55mm x 0.85mm); Supplier 1: DigiKey; Supplier Part Number 1: 541-715KHCT-ND; Supplier Device Package: 0603; Tolerance: ±1%
R116 = CRCW060310M0FKEA: RES SMD 10M OHM 1% 1/10W 0603; Manufacturer: Vishay Dale; Power (Watts): 0.1W, 1/10W; Temperature Coefficient: ±100ppm/°C; Part Number: CRCW060310M0FKEA; Value: 10 MOhms; ComponentLink1Description: Datasheet; ComponentLink1URL: http://www.vishay.com/docs/20035/dcrcwe3.pdf; ComponentLink2Description: DigiKey Link; ComponentLink2URL: http://digikey.com/product-detail/en/vishay-dale/CRCW060310M0FKEA/541-10.0MHCT-ND/1180266; Composition: Thick Film; Device Package: 0603 (1608 Metric); Features: Automotive AEC-Q200; Height - Seated (Max): 0.020" (0.50mm); LastUpdated: 9/2/2020 1:10:08 AM; Lifecycle Status: Active; Minimum Order: 1; Number of Terminations: 2; Operating Temperature: -55°C ~ 155°C; Package / Case: 0603 (1608 Metric); Packaging: CutTape; PartId: 12816; Part Status: Active; Price: 0.10; Ratings: AEC-Q200; Resistance: 10 MOhms; Series: CRCW; Size / Dimension: 0.061" L x 0.033" W (1.55mm x 0.85mm); Supplier 1: DigiKey; Supplier Part Number 1: 541-10.0MHCT-ND; Supplier Device Package: 0603; Tolerance: ±1%
R117 = CRCW06031M00FKEA: RES SMD 1M OHM 1% 1/10W 0603; Manufacturer: Vishay Dale; Power (Watts): 0.1W, 1/10W; Temperature Coefficient: ±100ppm/°C; Part Number: CRCW06031M00FKEA; Value: 1 MOhms; ComponentLink1Description: Datasheet; ComponentLink1URL: http://www.vishay.com/docs/20035/dcrcwe3.pdf; ComponentLink2Description: DigiKey Link; ComponentLink2URL: http://digikey.com/product-detail/en/vishay-dale/CRCW06031M00FKEA/541-1.00MHCT-ND/1180152; Composition: Thick Film; Device Package: 0603 (1608 Metric); Features: Automotive AEC-Q200; Height - Seated (Max): 0.020" (0.50mm); LastUpdated: 9/2/2020 1:10:09 AM; Lifecycle Status: Active; Minimum Order: 1; Number of Terminations: 2; Operating Temperature: -55°C ~ 155°C; Package / Case: 0603 (1608 Metric); Packaging: CutTape; PartId: 12567; Part Status: Active; Price: 0.10; Ratings: AEC-Q200; Resistance: 1 MOhms; Series: CRCW; Size / Dimension: 0.061" L x 0.033" W (1.55mm x 0.85mm); Supplier 1: DigiKey; Supplier Part Number 1: 541-1.00MHCT-ND; Supplier Device Package: 0603; Tolerance: ±1%
R118 = CRCW0603115KFKEA: RES SMD 115K OHM 1% 1/10W 0603; Manufacturer: Vishay Dale; Power (Watts): 0.1W, 1/10W; Temperature Coefficient: ±100ppm/°C; Part Number: CRCW0603115KFKEA; Value: 115 kOhms; ComponentLink1Description: Datasheet; ComponentLink1URL: http://www.vishay.com/docs/20035/dcrcwe3.pdf; ComponentLink2Description: DigiKey Link; ComponentLink2URL: http://digikey.com/product-detail/en/vishay-dale/CRCW0603115KFKEA/541-115KHCT-ND/1180044; Composition: Thick Film; Device Package: 0603 (1608 Metric); Features: Automotive AEC-Q200; Height - Seated (Max): 0.020" (0.50mm); LastUpdated: 9/2/2020 1:09:37 AM; Lifecycle Status: Active; Minimum Order: 1; Number of Terminations: 2; Operating Temperature: -55°C ~ 155°C; Package / Case: 0603 (1608 Metric); Packaging: CutTape; PartId: 24531; Part Status: Active; Price: 0.10; Ratings: AEC-Q200; Resistance: 115 kOhms; Series: CRCW; Size / Dimension: 0.061" L x 0.033" W (1.55mm x 0.85mm); Supplier 1: DigiKey; Supplier Part Number 1: 541-115KHCT-ND; Supplier Device Package: 0603; Tolerance: ±1%
R119 = CRCW0603240KFKEA: RES SMD 240K OHM 1% 1/10W 0603; Manufacturer: Vishay Dale; Power (Watts): 0.1W, 1/10W; Temperature Coefficient: ±100ppm/°C; Part Number: CRCW0603240KFKEA; Value: 240 kOhms; ComponentLink1Description: Datasheet; ComponentLink1URL: http://www.vishay.com/docs/20035/dcrcwe3.pdf; ComponentLink2Description: DigiKey Link; ComponentLink2URL: http://digikey.com/product-detail/en/vishay-dale/CRCW0603240KFKEA/541-240KHCT-ND/1180079; Composition: Thick Film; Device Package: 0603 (1608 Metric); Features: Automotive AEC-Q200; Height - Seated (Max): 0.020" (0.50mm); LastUpdated: 9/2/2020 1:10:18 AM; Lifecycle Status: Active; Minimum Order: 1; Number of Terminations: 2; Operating Temperature: -55°C ~ 155°C; Package / Case: 0603 (1608 Metric); Packaging: CutTape; PartId: 7880; Part Status: Active; Price: 0.10; Ratings: AEC-Q200; Resistance: 240 kOhms; Series: CRCW; Size / Dimension: 0.061" L x 0.033" W (1.55mm x 0.85mm); Supplier 1: DigiKey; Supplier Part Number 1: 541-240KHCT-ND; Supplier Device Package: 0603; Tolerance: ±1%
R120 R121 = CRCW2512604RFKEG: RES SMD 604 OHM 1% 1W 2512; Manufacturer: Vishay Dale; Temperature Coefficient: ±100ppm/°C; Part Number: CRCW2512604RFKEG; ComponentLink1Description: Datasheet; ComponentLink1URL: http://www.vishay.com/docs/20035/dcrcwe3.pdf; ComponentLink2Description: DigiKey Link; ComponentLink2URL: http://digikey.com/product-detail/en/vishay-dale/CRCW2512604RFKEG/541-604AFCT-ND/3232081; Composition: Thick Film; Device Package: 2512 (6432 Metric); Features: Automotive AEC-Q200; Height - Seated (Max): 0.028" (0.70mm); LastUpdated: 9/2/2020 1:26:58 AM; Lifecycle Status: Active; Minimum Order: 1; Number of Terminations: 2; Operating Temperature: -55°C ~ 155°C; Package / Case: 2512 (6432 Metric); Packaging: TapeAndReel; Part Status: Active; Power (Watts): 1W; Price: 0.04; Ratings: AEC-Q200; Resistance: 604 Ohms; Series: CRCW; Size / Dimension: 0.248" L x 0.124" W (6.30mm x 3.15mm); Supplier 1: DigiKey; Supplier Part Number 1: 541-604AFCT-ND; Supplier Device Package: 2512; Tolerance: ±1%; Value: 604 Ohms
R122-R125 = CRCW0603100RFKTA: RES SMD 100 OHM 1% 1/10W 0603; Manufacturer: Vishay Dale; Power (Watts): 0.1W, 1/10W; Temperature Coefficient: ±100ppm/°C; Part Number: CRCW0603100RFKTA; Value: 100 Ohms; ComponentLink1Description: Datasheet; ComponentLink1URL: http://www.vishay.com/docs/20008/dcrcw.pdf; ComponentLink2Description: DigiKey Link; ComponentLink2URL: http://digikey.com/product-detail/en/vishay-dale/CRCW0603100RFKTA/541-2976-1-ND/6073619; Composition: Thick Film; Device Package: 0603 (1608 Metric); Features: Automotive AEC-Q200; Height - Seated (Max): 0.020" (0.50mm); LastUpdated: 9/2/2020 1:09:58 AM; Lifecycle Status: Active; Minimum Order: 1; Number of Terminations: 2; Operating Temperature: -55°C ~ 155°C; Package / Case: 0603 (1608 Metric); Packaging: TapeAndReel; PartId: 17521; Part Status: Active; Price: 0.01; Ratings: AEC-Q200; Resistance: 100 Ohms; Series: CRCW; Size / Dimension: 0.063" L x 0.033" W (1.60mm x 0.85mm); Supplier 1: DigiKey; Supplier Part Number 1: 541-2976-1-ND; Supplier Device Package: 0603; Tolerance: ±1%
R126 R127 = PMR100HZPJV2L0: RES 0.002 OHM 5% 2W 2512; Manufacturer: Rohm Semiconductor; Temperature Coefficient: ±150ppm/°C; Part Number: PMR100HZPJV2L0; Package / Case: 2512 (6432 Metric); ComponentLink1Description: Datasheet; ComponentLink1URL: https://www.rohm.com/datasheet/PMR18EZPFV/pmr-e; ComponentLink2Description: DigiKey Link; ComponentLink2URL: http://digikey.com/product-detail/en/rohm-semiconductor/PMR100HZPJV2L0/RHM.002AVCT-ND/2094573; Composition: Thick Film; Device Package: 2512 (6432 Metric); Features: Automotive AEC-Q200, Current Sense; Height - Seated (Max): 0.019" (0.47mm); LastUpdated: 9/2/2020 1:18:06 AM; Lifecycle Status: Active; Minimum Order: 1; Number of Terminations: 2; Operating Temperature: -55°C ~ 155°C; Packaging: TapeAndReel; PartId: 1522; Part Status: Active; Power (Watts): 2W; Price: 0.19; Ratings: AEC-Q200; Resistance: 2 mOhms; Series: PMR; Size / Dimension: 0.252" L x 0.126" W (6.40mm x 3.20mm); Supplier 1: DigiKey; Supplier Part Number 1: RHM.002AVCT-ND; Supplier Device Package: 2512; Tolerance: ±5%; Value: 2 mOhms
U8 = LM5164DDAT: Buck Switching Regulator IC Positive Adjustable 1.2V 1 Output 1A 8-PowerSOIC (0.154", 3.90mm Width); SourceLibrary: TI_2020-05-18; Built_By: EMA_Jessica; Vendor: Texas Instruments; Copyright: Copyright (C) 2018 Accelerated Designs. All rights reserved; Manufacturer_Part_Number: LM5164DDAT; RefDes: RefDes; Type: DEV; Supplier 1: Mouser; Manufacturer: Texas Instruments; Manufacturer Part Number: LM5164DDAT; Stock 1: 472; Pricing 1: 1=4.11, 10=3.69, 25=3.49, 100=2.87, 250=2.58, 500=2.48 (USD); Supplier 2: Digi-Key; Stock 2: 1139; Pricing 2: 1=4.1, 10=3.687, 25=3.4852, 100=2.8657 (USD); Supplier Part Number 1: 595-LM5164DDAT; Supplier Part Number 2: 296-53428-6-ND; ComponentLink1Description: Datasheet; ComponentLink1URL: https://www.ti.com/lit/ds/symlink/lm5164.pdf?HQS=TI-null-null-digikeymode-df-pf-null-wwe&ts=1601836871734